# EAGLE schematic Incubadora_huevos (EAGLE 7.6.0)
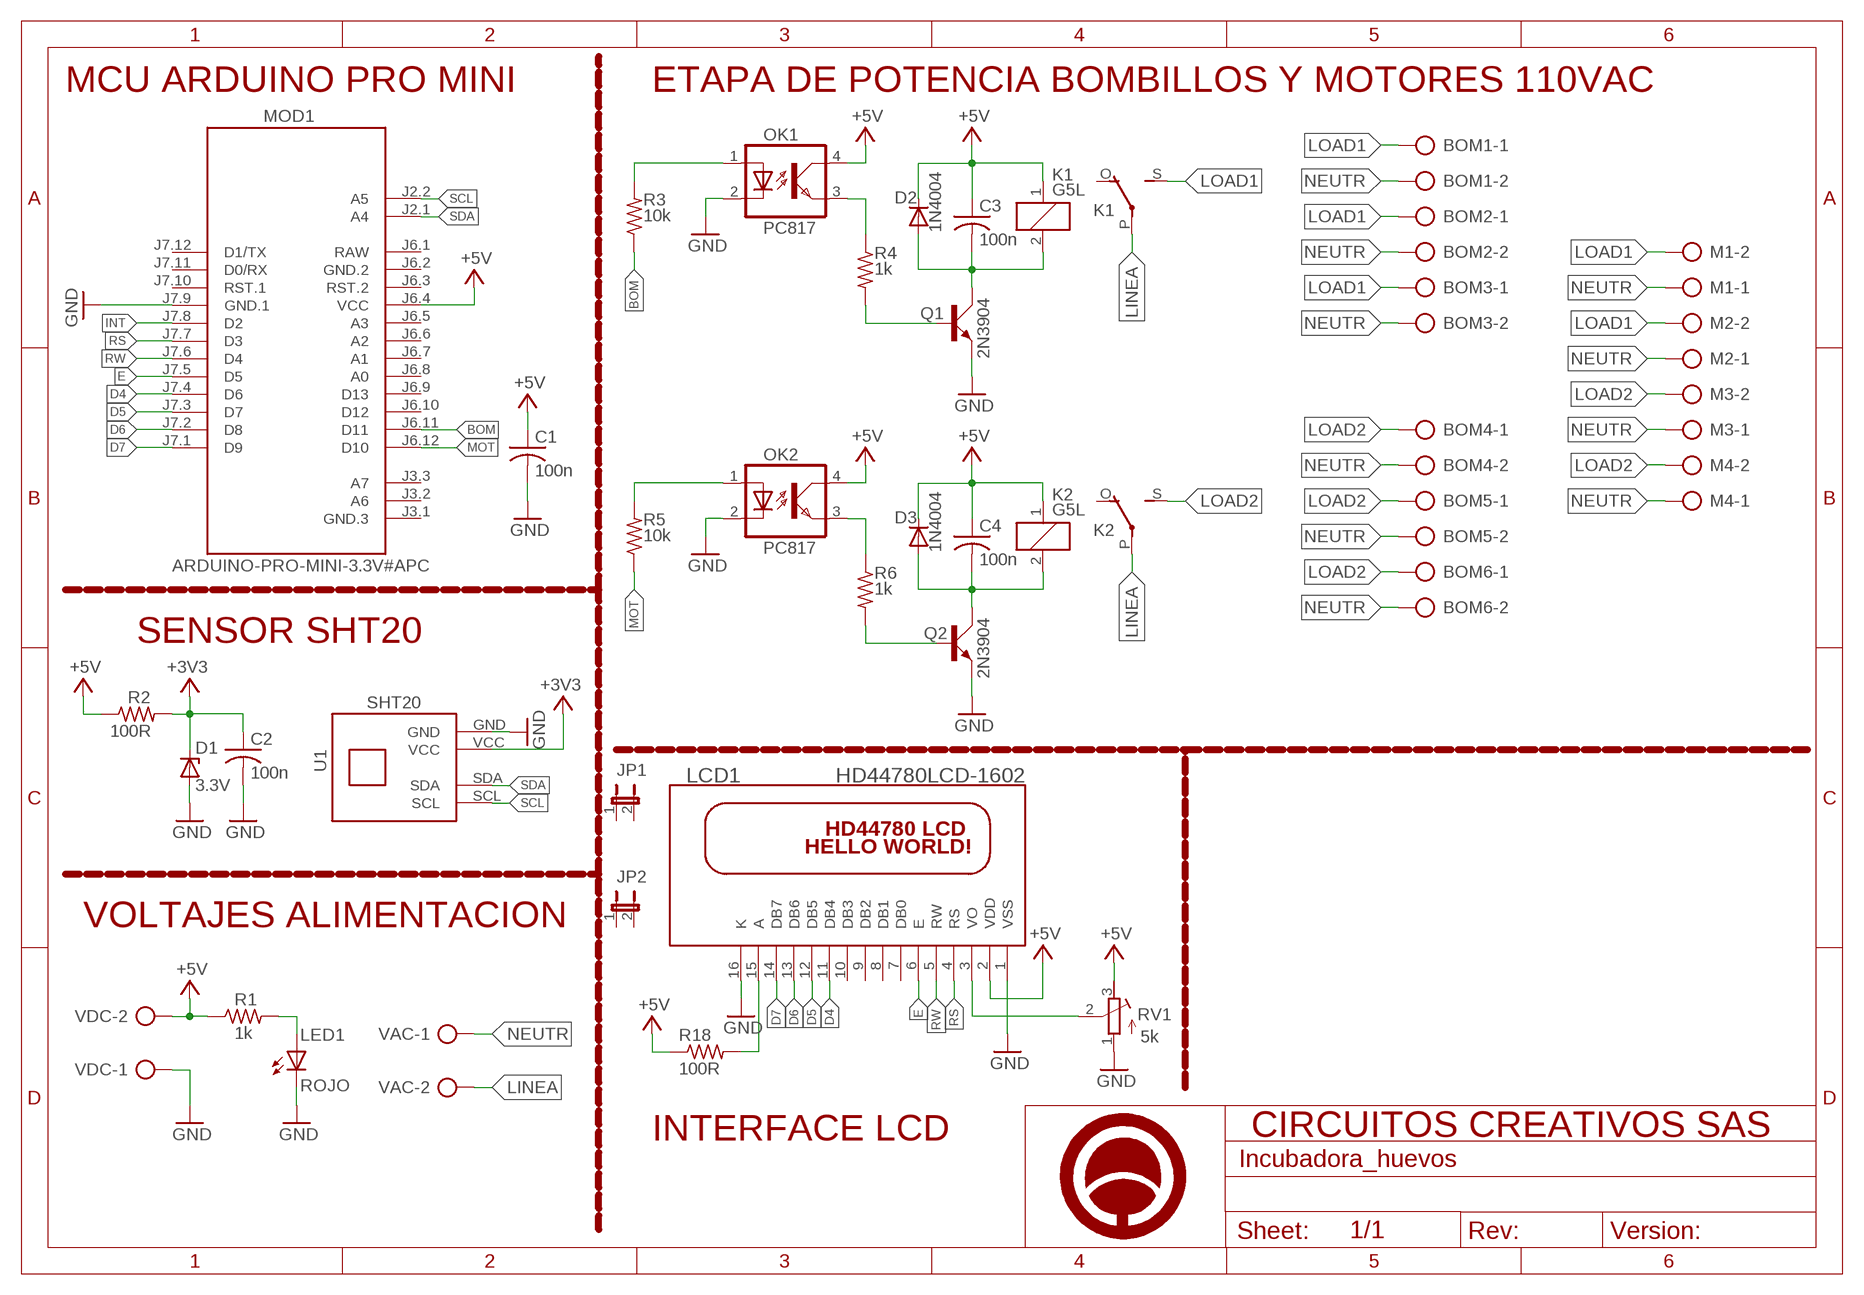
[diagram p0: schematic, sheet 1]

## Parts
BOM1  AK500/2  [AK500/2]
BOM2  AK500/2  [AK500/2]
BOM3  AK500/2  [AK500/2]
BOM4  AK500/2  [AK500/2]
BOM5  AK500/2  [AK500/2]
BOM6  AK500/2  [AK500/2]
C1  100n  C-US025-025X050  [C025-025X050]
C2  100n  C-US025-025X050  [C025-025X050]
C3  100n  C-US025-025X050  [C025-025X050]
C4  100n  C-US025-025X050  [C025-025X050]
D1  3.3V  ZENER-DIODEDO41Z10  [DO41Z10]
D2  1N4004  [DO41-10]
D3  1N4004  [DO41-10]
JP1  JP1E  [JP1]
JP2  JP1E  [JP1]
K1  G5L  [G5LE]
K2  G5L  [G5LE]
LCD1  HD44780LCD-1602  [LCD1602]
LED1  ROJO  LED3MM  [LED3MM]
M1  AK500/2  [AK500/2]
M2  AK500/2  [AK500/2]
M3  AK500/2  [AK500/2]
M4  AK500/2  [AK500/2]
MOD1  ARDUINO-PRO-MINI-3.3V#APC  [ARDUINO-PRO-MINI#APC]
OK1  PC817  [DIL04]
OK2  PC817  [DIL04]
Q1  2N3904  [TO92D]
Q2  2N3904  [TO92D]
R1  1k  R-US_0204/7  [0204/7]
R2  100R  R-US_0204/7  [0204/7]
R3  10k  R-US_0204/7  [0204/7]
R4  1k  R-US_0204/7  [0204/7]
R5  10k  R-US_0204/7  [0204/7]
R6  1k  R-US_0204/7  [0204/7]
R18  100R  R-US_0204/7  [0204/7]
RV1  5k  R-TRIMM3296W  [RTRIM3296W]
U1  SHT20  [SHT20]
U$1  A4_HORIZONTAL  [LOGO]
VAC  AK500/2  [AK500/2]
VDC  AK500/2  [AK500/2]

## Nets
+3V3: C2.1 D1.C R2.2 U1.VCC
+5V: C1.1 C3.1 C4.1 D2.C D3.C K1.1 K2.1 LCD1.2(VDD) MOD1.J6.4(VCC) OK1.4(COL) OK2.4(COL) R1.1 R2.1 R18.1 RV1.3(E) VDC.2
BOM: MOD1.J6.11(D11) R3.1
D4: LCD1.11(DB4) MOD1.J7.4(D6)
D5: LCD1.12(DB5) MOD1.J7.3(D7)
D6: LCD1.13(DB6) MOD1.J7.2(D8)
D7: LCD1.14(DB7) MOD1.J7.1(D9)
E: LCD1.6(E) MOD1.J7.5(D5)
GND: C1.2 C2.2 D1.A LCD1.1(VSS) LCD1.16(K) LED1.K(C) MOD1.J7.9(GND.1) OK1.2(C) OK2.2(C) Q1.E Q2.E RV1.1(A) U1.GND VDC.1
INT: MOD1.J7.8(D2)
LINEA: K1.P(2:P) K2.P(2:P) VAC.2
LOAD1: BOM1.1 BOM2.1 BOM3.1 K1.S(2:S) M1.2 M2.2
LOAD2: BOM4.1 BOM5.1 BOM6.1 K2.S(2:S) M3.2 M4.2
MOT: MOD1.J6.12(D10) R5.1
N$1: LED1.A R1.2
N$2: OK1.3(EMIT) R4.1
N$3: Q1.B R4.2
N$4: OK1.1(A) R3.2
N$5: C4.2 D3.A K2.2 Q2.C
N$6: OK2.3(EMIT) R6.1
N$7: Q2.B R6.2
N$8: OK2.1(A) R5.2
N$21: C3.2 D2.A K1.2 Q1.C
N$34: LCD1.3(VO) RV1.2(S)
N$46: LCD1.15(A) R18.2
NEUTR: BOM1.2 BOM2.2 BOM3.2 BOM4.2 BOM5.2 BOM6.2 M1.1 M2.1 M3.1 M4.1 VAC.1
RS: LCD1.4(RS) MOD1.J7.7(D3)
RW: LCD1.5(RW) MOD1.J7.6(D4)
SCL: MOD1.J2.2(A5) U1.SCL
SDA: MOD1.J2.1(A4) U1.SDA
Unconnected: JP1.1 JP1.2 JP2.1 JP2.2 K1.O(2:O) K2.O(2:O) LCD1.7(DB0) LCD1.8(DB1) LCD1.9(DB2) LCD1.10(DB3) MOD1.J3.1(GND.3) MOD1.J3.2(A6) MOD1.J3.3(A7) MOD1.J6.3(RST.2) MOD1.J6.5(A3) MOD1.J6.6(A2) MOD1.J6.7(A1) MOD1.J6.8(A0) MOD1.J6.9(D13) MOD1.J6.10(D12) MOD1.J7.10(RST.1) MOD1.J7.11(D0/RX) MOD1.J7.12(D1/TX)

## Notes on the sheet
- MCU ARDUINO PRO MINI | ETAPA DE POTENCIA BOMBILLOS Y MOTORES 110VAC
- SENSOR SHT20
- VOLTAJES ALIMENTACION
- INTERFACE LCD

## Power pins joined to a net without a drawn wire
GND.2: MOD1.J6.2(GND.2)
RAW: MOD1.J6.1(RAW)

## Library data of the parts
BOM1-BOM6 M1-M4 VAC VDC = con-ptr500:AK500/2: CONNECTOR; OC_FARNELL: unknown; OC_NEWARK: unknown
C1-C4 = rcl:C-US: CAPACITOR, American symbol
D1 = diode:ZENER-DIODE: Z-Diode
D2 D3 = adafruit:1N4004: DIODE General purpose 1N400x type rectifier (With bigger pads) http://www.ladyada.net/library/pcb/eaglelibrary.html
JP1 JP2 = jumper:JP1E: JUMPER
K1 K2 = relay:G5L: RELAY 1 x switch, 10 A/120 V AC, 8 A/30 V ADC, Omron; OC_FARNELL: unknown; OC_NEWARK: unknown
LCD1 = adafruit:HD44780LCD: HD44780 LCD Standard character type LCDs, available in sizes from 8x1 to 40x4!
LED1 = led:LED: LED OSRAM: - CHIPLED LG R971, LG N971, LY N971, LG Q971, LY Q971, LO R971, LY R971 LH N974, LH R974 LS Q976, LO Q976, LY Q976 LO Q996 - Hyper CHIPLED LW Q18S LB Q993, LB Q99A, LB R99A - SideLED LS A670, LO A670, LY A670, LG A670, LP A670 LB A673, LV A673, LT A673, LW A673 LH A674 LY A675 LS A676, LA A676, LO A676, LY A676, LW A676 LS A679, LY A679, LG A679 - Hyper Micro SIDELED® LS Y876, LA Y876, LO Y876, LY Y876 LT Y87S - SmartLED LW L88C, LW L88S LB L89C, LB L89S, LG L890 LS L89K, LO L89K, LY L89K LS L896, LA L896, LO L896, LY L896 - TOPLED LS T670, LO T670, LY T670, LG T670, LP T670 LSG T670, LSP T670, LSY T670, LOP T670, LYG T670 LG T671, LOG T671, LSG T671 LB T673, LV T673, LT T673, LW T673 LH T674 LS T676, LA T676, LO T676, LY T676, LB T676, LH T676, LSB T676, LW T676 LB T67C, LV T67C, LT T67C, LS T67K, LO T67K, LY T67K, LW E67C LS E67B, LA E67B, LO E67B, LY E67B, LB E67C, LV E67C, LT E67C LW T67C LS T679, LY T679, LG T679 LS T770, LO T770, LY T770, LG T770, LP T770 LB T773, LV T773, LT T773, LW T773 LH T774 LS E675, LA E675, LY E675, LS T675 LS T776, LA T776, LO T776, LY T776, LB T776 LHGB T686 LT T68C, LB T68C - Hyper Mini TOPLED® LB M676 - Mini TOPLED Santana® LG M470 LS M47K, LO M47K, LY M47K Source: http://www.osram.convergy.de LUXEON: - LUMILED® LXK2-PW12-R00, LXK2-PW12-S00, LXK2-PW14-U00, LXK2-PW14-V00 LXK2-PM12-R00, LXK2-PM12-S00, LXK2-PM14-U00 LXK2-PE12-Q00, LXK2-PE12-R00, LXK2-PE12-S00, LXK2-PE14-T00, LXK2-PE14-U00 LXK2-PB12-K00, LXK2-PB12-L00, LXK2-PB12-M00, LXK2-PB14-N00, LXK2-PB14-P00, LXK2-PB14-Q00 LXK2-PR12-L00, LXK2-PR12-M00, LXK2-PR14-Q00, LXK2-PR14-R00 LXK2-PD12-Q00, LXK2-PD12-R00, LXK2-PD12-S00 LXK2-PH12-R00, LXK2-PH12-S00 LXK2-PL12-P00, LXK2-PL12-Q00, LXK2-PL12-R00 Source: www.luxeon.com KINGBRIGHT: KA-3528ASYC Source: www.kingbright.com
MOD1 = DIY- comercial modules:ARDUINO-PRO-MINI-*#APC: Arduino Pro Mini (and compatible devices) with angle programming connector More details available here: https://www.arduino.cc/en/Main/ArduinoBoardProMini Click here to find device on ebay.com <http://www.ebay.com/sch/arduino+pro+mini>
OK1 OK2 = optocoupler:PC817: SHARP OPTO COUPLER; MPN: PC817X4J000F; OC_FARNELL: 9707727; OC_NEWARK: 97K7059
Q1 Q2 = transistor-small-signal:2N3904: NPN TRANSISTOR
R1-R6 R18 = rcl:R-US_: RESISTOR, American symbol
RV1 = rcl:R-TRIMM: Trimm resistor
U1 = Circuitos-Creativos-Sensores:SHT20
U$1 = Circuitos-Creativos-Estilos:A4_HORIZONTAL

## Net classes
1 PWR: width 0.305 mm, clearance 0.254 mm